# Altium project 06_Dataflow_Modeling.PrjPcb
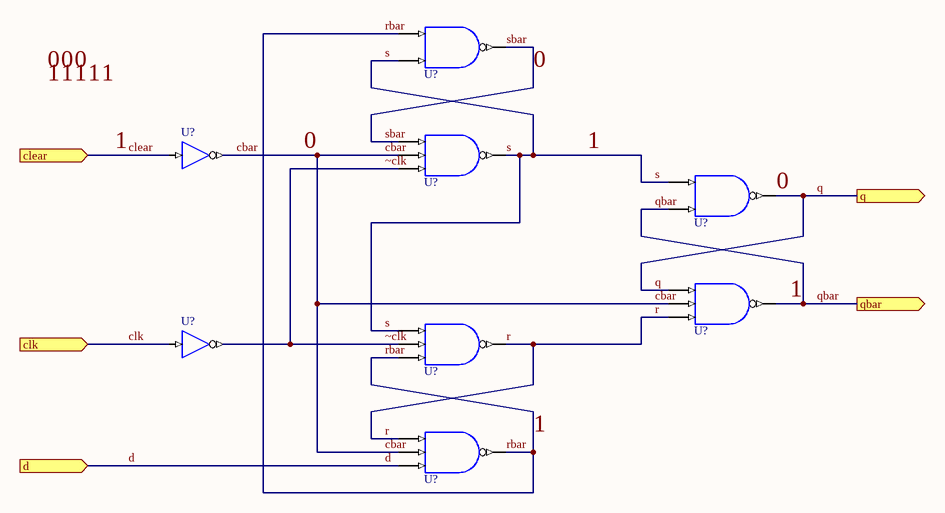
[diagram p0: edge_dff.SchDoc]
5 sheets, 36 parts. Net scope: flat (ports and power ports of the same name join across sheets).
Sheets:
  edge_dff.SchDoc
  edge_dff_drafts.SchDoc
  edge_dff_rst_active.SchDoc
  edge_dff_clk_high.SchDoc
  edge_dff_clk_low.SchDoc

## Sheet edge_dff.SchDoc
size A4

### Parts
(Parts that share a designator on the sheet are numbered #1, #2 ... from top to bottom, then left to right.)
U?#1  AND 2  (value not drawn)
U?#2  NAND_3  (value not drawn)
U?#3  BUF_inv  (value not drawn)
U?#4  AND 2  (value not drawn)
U?#5  NAND_3  (value not drawn)
U?#6  NAND_3  (value not drawn)
U?#7  BUF_inv  (value not drawn)
U?#8  NAND_3  (value not drawn)

### Ports
clear (in), clk (in), d (in), q (out), qbar (out)

### Nets
0: U?#1.Y U?#2.A U?#2.B U?#3.O U?#4.Y U?#5.A U?#5.B U?#8.B ; port q  [also labelled cbar, q, sbar]
1: U?#1.A U?#1.B U?#2.Y U?#3.I U?#4.A U?#4.B U?#5.Y U?#6.A U?#6.C U?#8.Y ; port clear, port qbar  [also labelled clear, qbar, rbar, s]
clk: U?#7.I ; port clk
d: U?#8.C ; port d
r: U?#5.C U?#6.Y U?#8.A
~clk: U?#2.C U?#6.B U?#7.O

### Notes on the sheet
- Labels drawn without touching a wire or pin: 0, 1

### Library data of the parts
U?#1 U?#4 = AND_2: 2 Input AND
U?#2 U?#5 U?#6 U?#8 = NAND_3: 3 Input NAND 1 Not
U?#3 U?#7 = BUF_inv: 1-bit General Purpose (Non-inverting) Buffer

## Sheet edge_dff_drafts.SchDoc
size A4
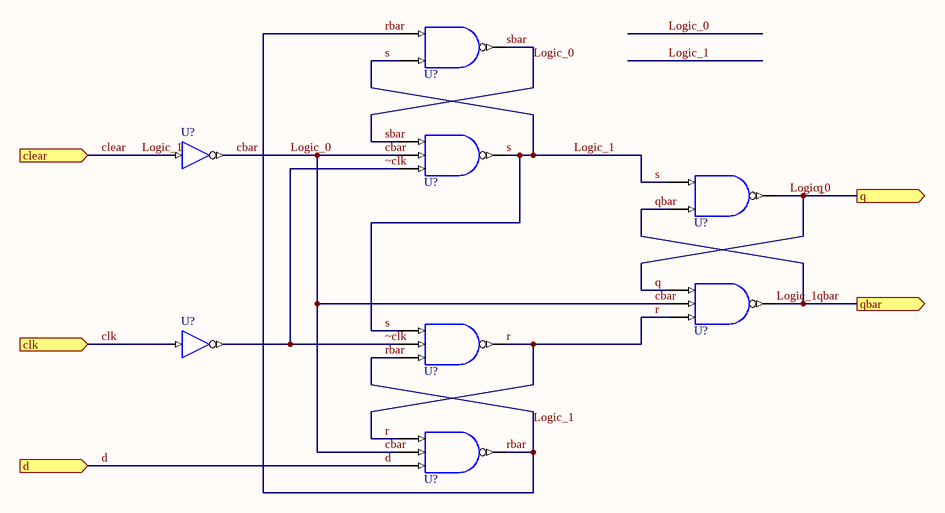
[diagram p1: edge_dff_drafts.SchDoc]

### Parts
(Parts that share a designator on the sheet are numbered #1, #2 ... from top to bottom, then left to right.)
U?#9  AND 2  (value not drawn)
U?#10  NAND_3  (value not drawn)
U?#11  BUF_inv  (value not drawn)
U?#12  AND 2  (value not drawn)
U?#13  NAND_3  (value not drawn)
U?#14  NAND_3  (value not drawn)
U?#15  BUF_inv  (value not drawn)
U?#16  NAND_3  (value not drawn)

### Ports
clear (in), clk (in), d (in), q (out), qbar (out)

### Nets
cbar: U?#9.Y U?#10.A U?#10.B U?#11.O U?#12.Y U?#13.A U?#13.B U?#16.B ; port q  [also labelled Logic_0, q, sbar]  [project net 0]
clear: U?#9.A U?#9.B U?#10.Y U?#11.I U?#12.A U?#12.B U?#13.Y U?#14.A U?#14.C U?#16.Y ; port clear, port qbar  [also labelled Logic_1, qbar, rbar, s]  [project net 1]
clk: U?#15.I ; port clk
d: U?#16.C ; port d
r: U?#13.C U?#14.Y U?#16.A
~clk: U?#10.C U?#14.B U?#15.O

### Library data of the parts
U?#9 U?#12 = AND_2: 2 Input AND
U?#10 U?#13 U?#14 U?#16 = NAND_3: 3 Input NAND 1 Not
U?#11 U?#15 = BUF_inv: as U?#3 on sheet edge_dff

## Sheet edge_dff_rst_active.SchDoc
size A4
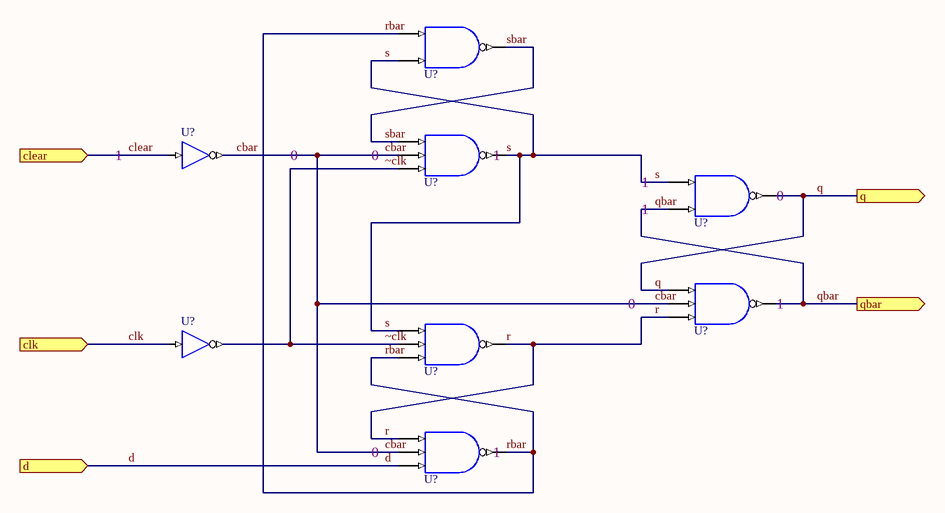
[diagram p2: edge_dff_rst_active.SchDoc]

### Parts
(Parts that share a designator on the sheet are numbered #1, #2 ... from top to bottom, then left to right.)
U?#17  AND 2  (value not drawn)
U?#18  NAND_3  (value not drawn)
U?#19  BUF_inv  (value not drawn)
U?#20  AND 2  (value not drawn)
U?#21  NAND_3  (value not drawn)
U?#22  NAND_3  (value not drawn)
U?#23  BUF_inv  (value not drawn)
U?#24  NAND_3  (value not drawn)

### Ports
clear (in), clk (in), d (in), q (out), qbar (out)

### Nets
cbar: U?#18.B U?#19.O U?#21.B U?#24.B
clear: U?#19.I U?#20.B U?#21.Y ; port clear, port qbar  [also labelled qbar]  [project net 1]
clk: U?#23.I ; port clk
d: U?#24.C ; port d
q: U?#20.Y U?#21.A ; port q  [project net 0]
r: U?#21.C U?#22.Y U?#24.A
rbar: U?#17.A U?#22.C U?#24.Y
s: U?#17.B U?#18.Y U?#20.A U?#22.A
sbar: U?#17.Y U?#18.A
~clk: U?#18.C U?#22.B U?#23.O

### Notes on the sheet
- 1
- 0
- (near U?#18) 0
- (near U?#18) 1
- (near U?#20) 1
- (near U?#20) 0
- (near U?#21) 1
- (near U?#24) 0
- (near U?#24) 1

### Library data of the parts
U?#17 U?#20 = AND_2: 2 Input AND
U?#18 U?#21 U?#22 U?#24 = NAND_3: 3 Input NAND 1 Not
U?#19 U?#23 = BUF_inv: as U?#3 on sheet edge_dff

## Sheet edge_dff_clk_high.SchDoc
size A4
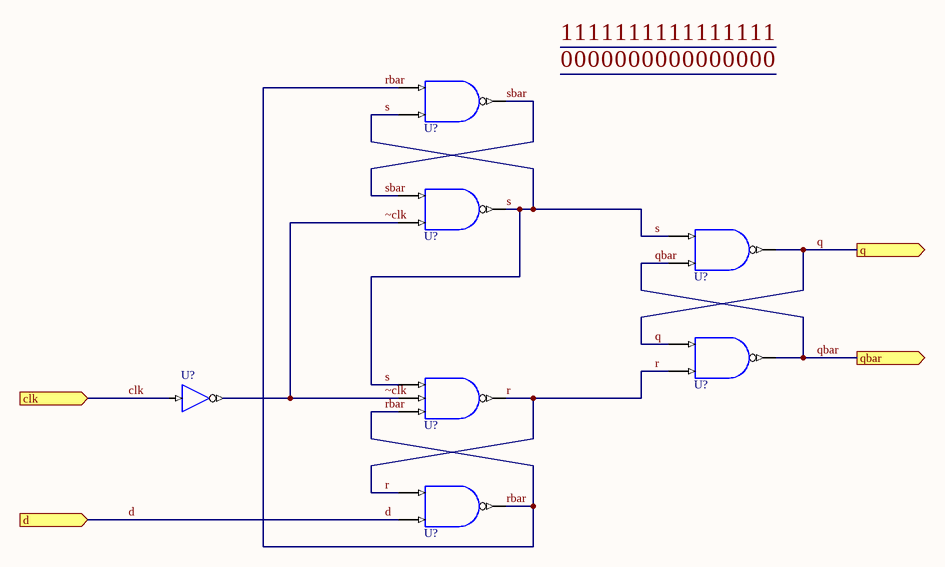
[diagram p3: edge_dff_clk_high.SchDoc]

### Parts
(Parts that share a designator on the sheet are numbered #1, #2 ... from top to bottom, then left to right.)
U?#25  AND 2  (value not drawn)
U?#26  AND 2  (value not drawn)
U?#27  AND 2  (value not drawn)
U?#28  AND 2  (value not drawn)
U?#29  NAND_3  (value not drawn)
U?#30  BUF_inv  (value not drawn)
U?#31  AND 2  (value not drawn)

### Ports
clk (in), d (in), q (out), qbar (out)

### Nets
clk: U?#30.I ; port clk
d: U?#31.B ; port d
q: U?#27.Y U?#28.A ; port q  [project net 0]
qbar: U?#27.B U?#28.Y ; port qbar  [project net 1]
r: U?#28.B U?#29.Y U?#31.A
rbar: U?#25.A U?#29.C U?#31.Y
s: U?#25.B U?#26.Y U?#27.A U?#29.A
sbar: U?#25.Y U?#26.A
~clk: U?#26.B U?#29.B U?#30.O

### Library data of the parts
U?#25-U?#28 U?#31 = AND_2: 2 Input AND
U?#29 = NAND_3: 3 Input NAND 1 Not
U?#30 = BUF_inv: as U?#3 on sheet edge_dff

## Sheet edge_dff_clk_low.SchDoc
size A4
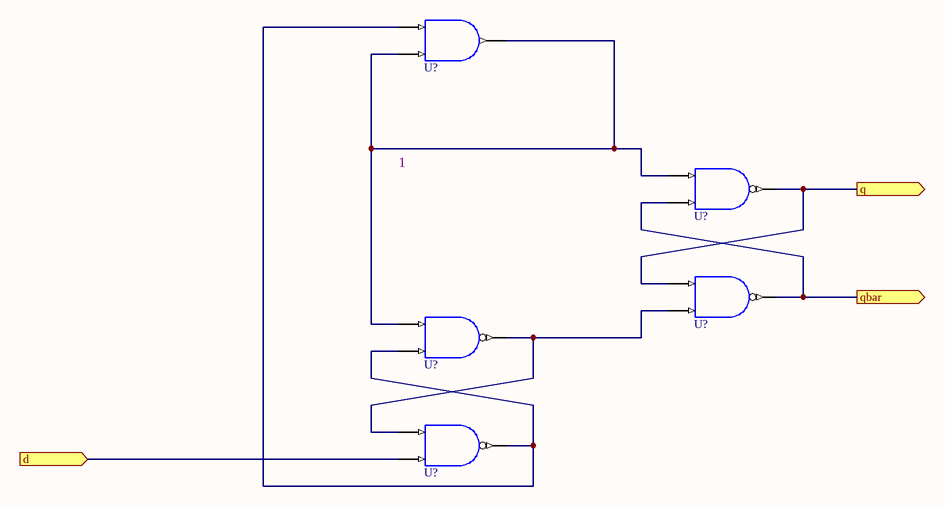
[diagram p4: edge_dff_clk_low.SchDoc]

### Parts
(Parts that share a designator on the sheet are numbered #1, #2 ... from top to bottom, then left to right.)
U?#32  AND 2  (value not drawn)
U?#33  AND 2  (value not drawn)
U?#34  AND 2  (value not drawn)
U?#35  AND 2  (value not drawn)
U?#36  AND 2  (value not drawn)

### Ports
d (in), q (out), qbar (out)

### Nets
0: U?#33.Y U?#34.A ; port q
1: U?#33.B U?#34.Y ; port qbar
d: U?#36.B ; port d
NetU?#32_A: U?#32.A U?#35.B U?#36.Y
NetU?#32_B: U?#32.B U?#32.Y U?#33.A U?#35.A
NetU?#34_B: U?#34.B U?#35.Y U?#36.A

### Notes on the sheet
- 1

### Library data of the parts
U?#32-U?#36 = AND_2: 2 Input AND

## Nets that join several sheets
0: edge_dff (8 pins), edge_dff_drafts (8 pins), edge_dff_rst_active (U?#20.Y U?#21.A), edge_dff_clk_high (U?#27.Y U?#28.A), edge_dff_clk_low (U?#33.Y U?#34.A)
1: edge_dff (10 pins), edge_dff_drafts (10 pins), edge_dff_rst_active (U?#19.I U?#20.B U?#21.Y), edge_dff_clk_high (U?#27.B U?#28.Y), edge_dff_clk_low (U?#33.B U?#34.Y)
clk: edge_dff (U?#7.I), edge_dff_drafts (U?#15.I), edge_dff_rst_active (U?#23.I), edge_dff_clk_high (U?#30.I)
d: edge_dff (U?#8.C), edge_dff_drafts (U?#16.C), edge_dff_rst_active (U?#24.C), edge_dff_clk_high (U?#31.B), edge_dff_clk_low (U?#36.B)